# Altium schematic sheet etna-main-usb.SchDoc
size A4; DocumentNumber: 1; SheetNumber: 1; SheetTotal: 5; PageSetup: Record=PageOptions|CenterHorizontal=True|CenterVertical=True|PrintScale=0.73|XCorrection=1.00|YCorrection=1.00|PrintKind=1|BorderSize=5000000|LeftOffset=0|BottomOffset=0|Orientation=2|PaperLength=1000|PaperWidth=1000|Scale=100|PaperSource=15|PrintQuality=1200|MediaType=1|DitherType=10|PaperKind=A4|PrintScaleMode=1
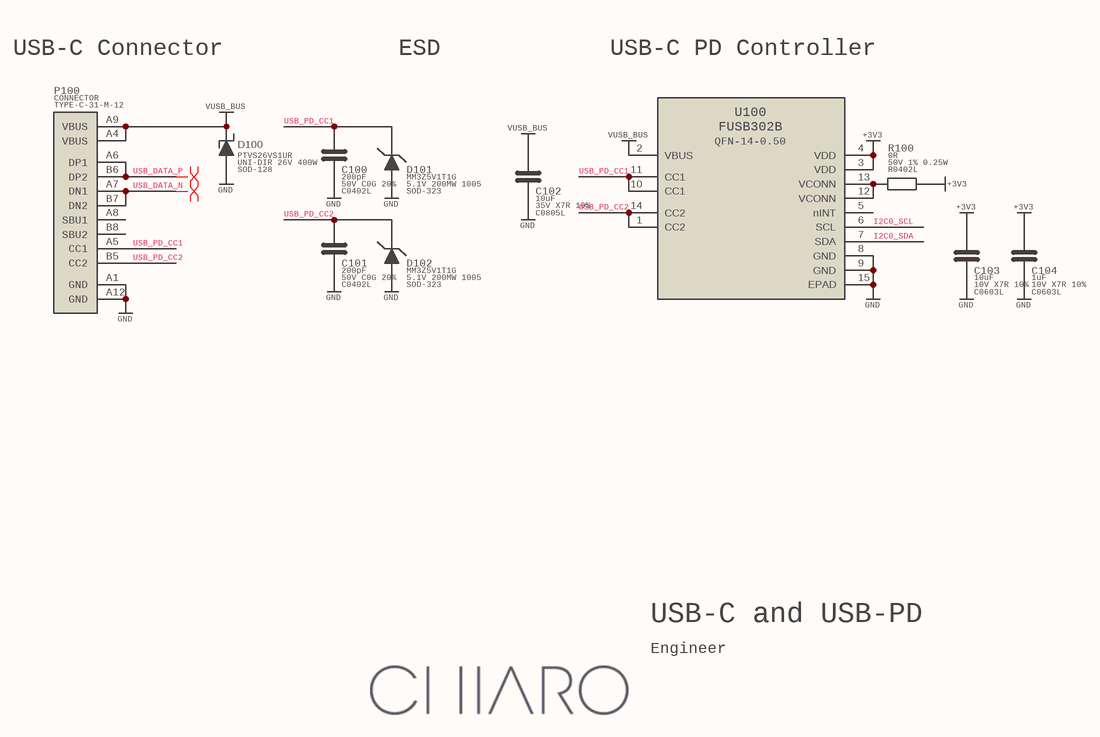
[diagram p0: etna-main-usb.SchDoc]

## Parts
C100  value 200pF  Specification: 50V C0G 20%  [C0402L]
C101  value 200pF  Specification: 50V C0G 20%  [C0402L]
C102  value 10uF  Specification: 35V X7R 10%  [C0805L]  (hidden comment: 100n)
C103  value 10uF  Specification: 10V X7R 10%  [C0603L]  (hidden comment: 100n)
C104  value 1uF  Specification: 10V X7R 10%  [C0603L]  (hidden comment: 100n)
D100  value PTVS26VS1UR  Specification: UNI-DIR 26V 400W  [SOD-128]  (hidden comment: DIODE_ZEN)
D101  value MM3Z5V1T1G  Specification: 5.1V 200MW 1005  [SOD-323]  (hidden comment: DIODE_TVS)
D102  value MM3Z5V1T1G  Specification: 5.1V 200MW 1005  [SOD-323]  (hidden comment: DIODE_TVS)
P100  value CONNECTOR  [TYPE-C-31-M-12]  (hidden comment: TYPE-C-31-M-12)
R100  value 0R  Specification: 50V 1% 0.25W  [R0402L]
U100  FUSB302B  [QFN-14-0.50]

## Nets
+3V3: C103.1 C104.1 R100.1 U100.3(VDD) U100.4(VDD)
GND: C100.2 C101.2 C102.2 C103.2 C104.2 D100.1(A) D101.1(A) D102.1(A) P100.A1(GND) P100.A12(GND) U100.8(GND) U100.9(GND) U100.15(EPAD)
VUSB_BUS: C102.1 D100.2(K) P100.A4(VBUS) P100.A9(VBUS) U100.2(VBUS)
I2C0_SCL: U100.6(SCL)
I2C0_SDA: U100.7(SDA)
USB_DATA_N: P100.A7(DN1) P100.B7(DN2)
USB_DATA_P: P100.A6(DP1) P100.B6(DP2)
USB_PD_CC1: C100.1 D101.2(K) P100.A5(CC1) U100.10(CC1) U100.11(CC1)
USB_PD_CC2: C101.1 D102.2(K) P100.B5(CC2) U100.1(CC2) U100.14(CC2)
NetR100_2: R100.2 U100.12(VCONN) U100.13(VCONN)

Not connected (* = marked no-connect by the designer): P100 A8(SBU1) B8(SBU2); U100 5(nINT) 44(N.C.)

## Layout directives
differential pair: USB_DATA_N, USB_DATA_P

## Notes on the sheet
- USB-C Connector
- ESD
- USB-C PD Controller
- USB-C and USB-PD
- Engineer

## Library data of the parts
C100-C104 = CAPACITOR_NONPOL
R100 = RESISTOR
U100 = FUSB302B: Value: FUSB302B